# Altium schematic sheet Connectors-SD.SchDoc
size B; SheetNumber: 2; SheetTotal: 5
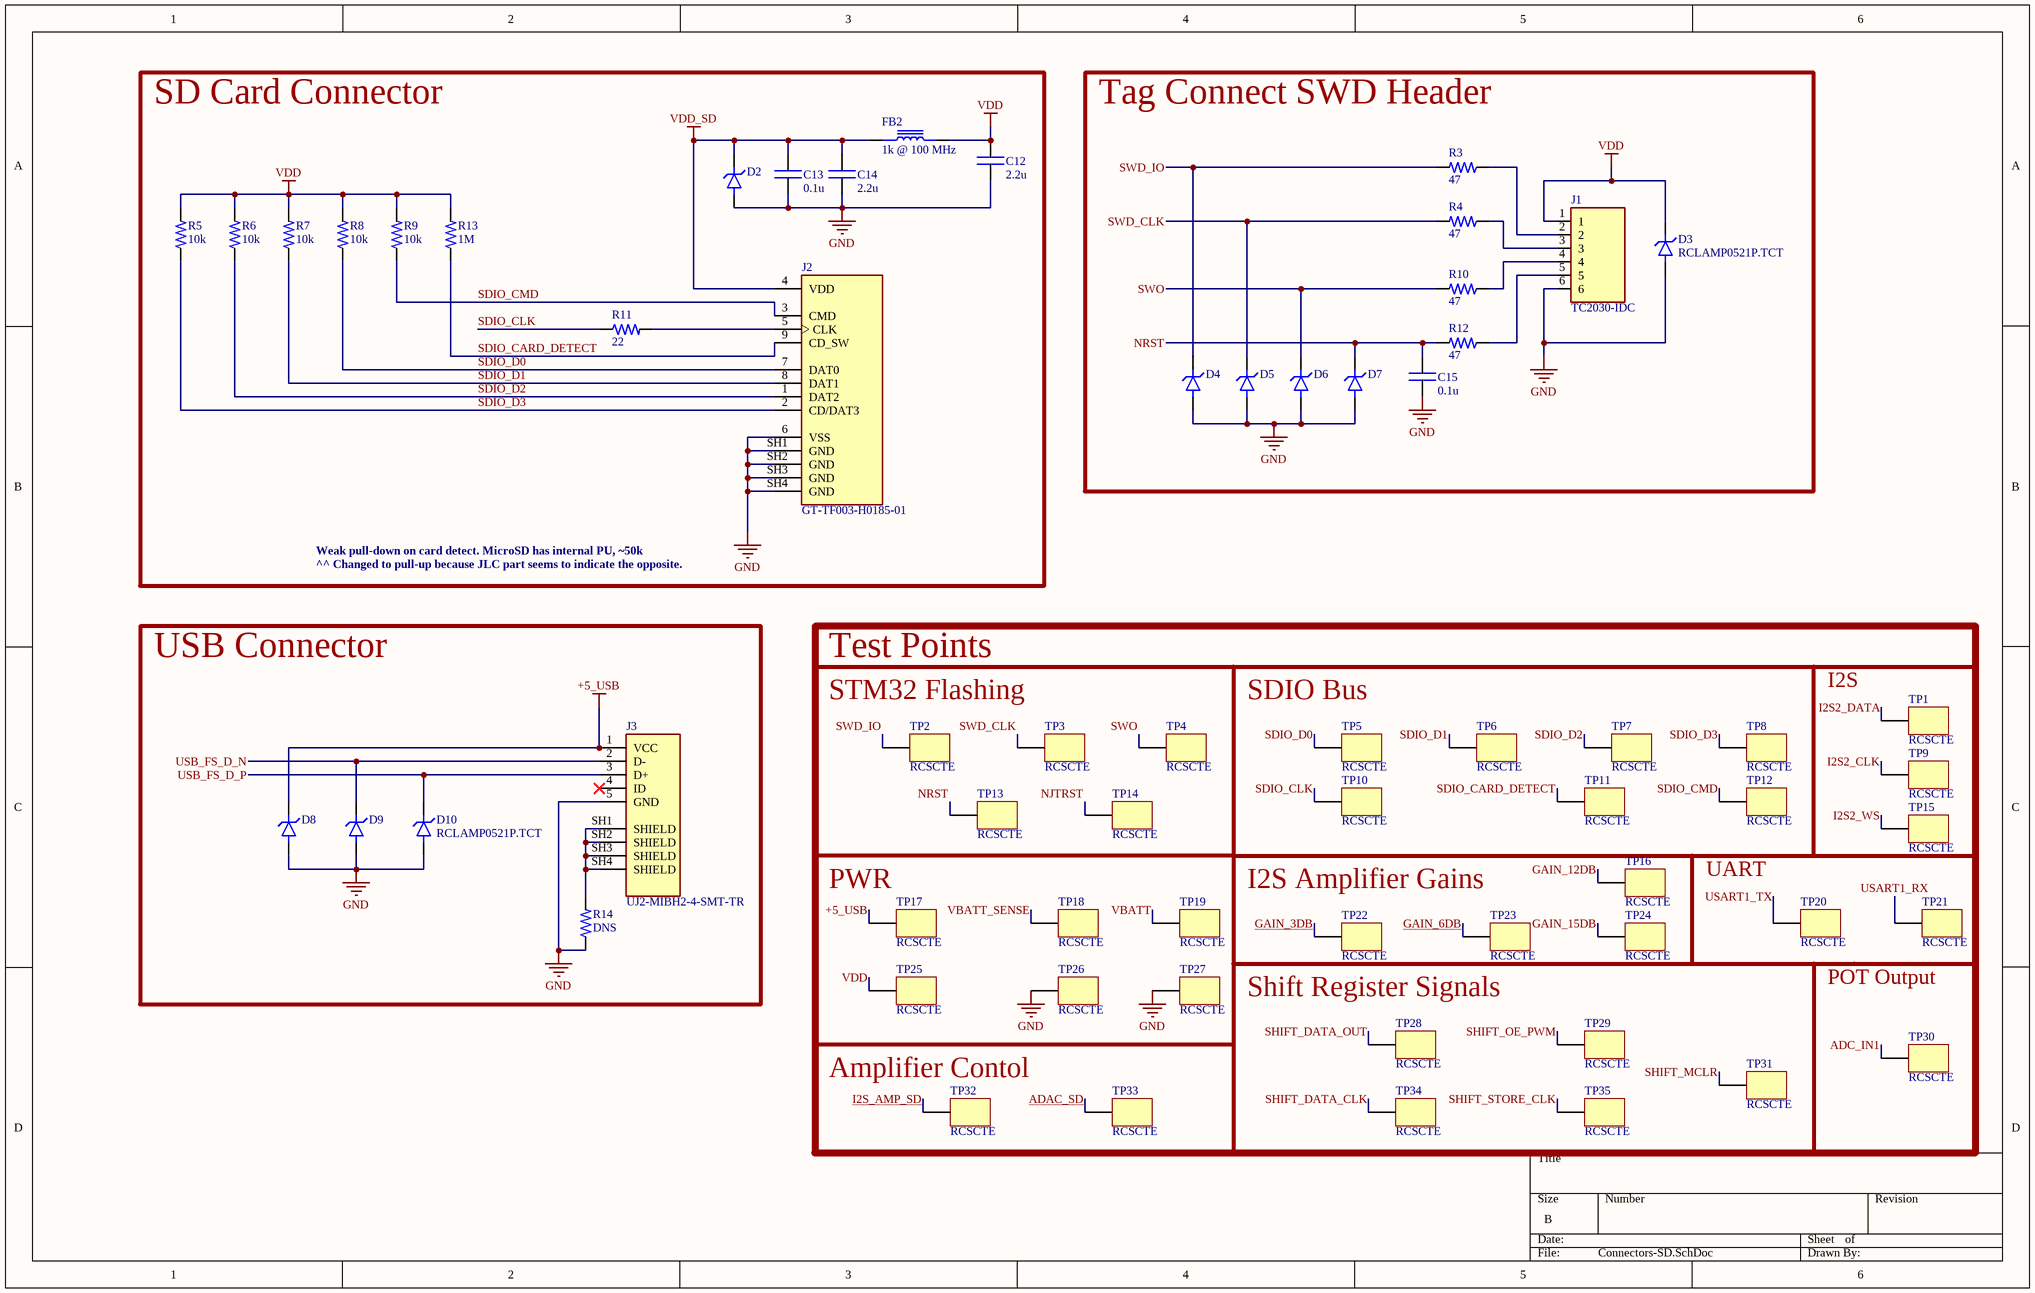
[diagram p0: Connectors-SD.SchDoc]

## Parts
C12  value 2.2u  [0603-CAP]  (hidden comment: CAP)
C13  value 0.1u  [0603-CAP]  (hidden comment: CAP)
C14  value 2.2u  [0603-CAP]  (hidden comment: CAP)
C15  value 0.1u  [0603-CAP]  (hidden comment: CAP)
D2  RCLAMP0521P.TCT  [RCLAMP0521P.TCT]  (value not drawn)
D3  RCLAMP0521P.TCT  [RCLAMP0521P.TCT]
D4  RCLAMP0521P.TCT  [RCLAMP0521P.TCT]  (value not drawn)
D5  RCLAMP0521P.TCT  [RCLAMP0521P.TCT]  (value not drawn)
D6  RCLAMP0521P.TCT  [RCLAMP0521P.TCT]  (value not drawn)
D7  RCLAMP0521P.TCT  [RCLAMP0521P.TCT]  (value not drawn)
D8  RCLAMP0521P.TCT  [RCLAMP0521P.TCT]  (value not drawn)
D9  RCLAMP0521P.TCT  [RCLAMP0521P.TCT]  (value not drawn)
D10  RCLAMP0521P.TCT  [RCLAMP0521P.TCT]
FB2  1k @ 100 MHz  [0603-FB]
J1  TC2030-IDC  [TAG CONNECT TC2030IDC - NO 3D MODEL]
J2  GT-TF003-H0185-01  [GTTF003H018501]
J3  UJ2-MIBH2-4-SMT-TR  [USB MICRO JLC]
R3  value 47  [0603-RES]  (hidden comment: RES)
R4  value 47  [0603-RES]  (hidden comment: RES)
R5  value 10k  [0603-RES]  (hidden comment: RES)
R6  value 10k  [0603-RES]  (hidden comment: RES)
R7  value 10k  [0603-RES]  (hidden comment: RES)
R8  value 10k  [0603-RES]  (hidden comment: RES)
R9  value 10k  [0603-RES]  (hidden comment: RES)
R10  value 47  [0603-RES]  (hidden comment: RES)
R11  value 22  [0603-RES]  (hidden comment: RES)
R12  value 47  [0603-RES]  (hidden comment: RES)
R13  value 1M  [0603-RES]  (hidden comment: RES)
R14  value DNS  [0603-RES]  (hidden comment: RES)
TP1  RCSCTE  [RCWCTE]
TP2  RCSCTE  [RCWCTE]
TP3  RCSCTE  [RCWCTE]
TP4  RCSCTE  [RCWCTE]
TP5  RCSCTE  [RCWCTE]
TP6  RCSCTE  [RCWCTE]
TP7  RCSCTE  [RCWCTE]
TP8  RCSCTE  [RCWCTE]
TP9  RCSCTE  [RCWCTE]
TP10  RCSCTE  [RCWCTE]
TP11  RCSCTE  [RCWCTE]
TP12  RCSCTE  [RCWCTE]
TP13  RCSCTE  [RCWCTE]
TP14  RCSCTE  [RCWCTE]
TP15  RCSCTE  [RCWCTE]
TP16  RCSCTE  [RCWCTE]
TP17  RCSCTE  [RCWCTE]
TP18  RCSCTE  [RCWCTE]
TP19  RCSCTE  [RCWCTE]
TP20  RCSCTE  [RCWCTE]
TP21  RCSCTE  [RCWCTE]
TP22  RCSCTE  [RCWCTE]
TP23  RCSCTE  [RCWCTE]
TP24  RCSCTE  [RCWCTE]
TP25  RCSCTE  [RCWCTE]
TP26  RCSCTE  [RCWCTE]
TP27  RCSCTE  [RCWCTE]
TP28  RCSCTE  [RCWCTE]
TP29  RCSCTE  [RCWCTE]
TP30  RCSCTE  [RCWCTE]
TP31  RCSCTE  [RCWCTE]
TP32  RCSCTE  [RCWCTE]
TP33  RCSCTE  [RCWCTE]
TP34  RCSCTE  [RCWCTE]
TP35  RCSCTE  [RCWCTE]

## Blocks framed on the sheet
SD Card Connector: C12-C14 D2 FB2 J2 R5-R9 R11 R13
Tag Connect SWD Header: C15 D3-D7 J1 R3 R4 R10 R12
USB Connector: D8-D10 J3 R14
Test Points: TP1-TP35

## Nets
+5_USB: D8.K J3.1(VCC) TP17.1
GND: C12.1 C13.1 C14.1 C15.1 D2.A D3.A D4.A D5.A D6.A D7.A D8.A D9.A D10.A J1.6 J2.6(VSS) J2.SH1(GND) J2.SH2(GND) J2.SH3(GND) J2.SH4(GND) J3.5(GND) R14.1 TP26.1 TP27.1
VDD: C12.2 D3.K FB2.2 J1.1 R5.2 R6.2 R7.2 R8.2 R9.2 R13.2 TP25.1
VDD_SD: C13.2 C14.2 D2.K FB2.1 J2.4(VDD)
ADAC_SD: TP33.1
ADC_IN1: TP30.1
GAIN_3DB: TP22.1
GAIN_6DB: TP23.1
GAIN_12DB: TP16.1
GAIN_15DB: TP24.1
I2S2_CLK: TP9.1
I2S2_DATA: TP1.1
I2S2_WS: TP15.1
I2S_AMP_SD: TP32.1
NJTRST: TP14.1
NRST: C15.2 D7.K R12.2 TP13.1
SDIO_CARD_DETECT: J2.9(CD_SW) R13.1 TP11.1
SDIO_CLK: R11.1 TP10.1
SDIO_CMD: J2.3(CMD) R9.1 TP12.1
SDIO_D0: J2.7(DAT0) R8.1 TP5.1
SDIO_D1: J2.8(DAT1) R7.1 TP6.1
SDIO_D2: J2.1(DAT2) R6.1 TP7.1
SDIO_D3: J2.2(CD/DAT3) R5.1 TP8.1
SHIFT_DATA_CLK: TP34.1
SHIFT_DATA_OUT: TP28.1
SHIFT_MCLR: TP31.1
SHIFT_OE_PWM: TP29.1
SHIFT_STORE_CLK: TP35.1
SWD_CLK: D5.K R4.2 TP3.1
SWD_IO: D4.K R3.2 TP2.1
SWO: D6.K R10.2 TP4.1
USART1_RX: TP21.1
USART1_TX: TP20.1
USB_FS_D_N: D9.K J3.2(D-)
USB_FS_D_P: D10.K J3.3(D+)
VBATT: TP19.1
VBATT_SENSE: TP18.1
NetJ1_2: J1.2 R3.1
NetJ1_3: J1.3 R4.1
NetJ1_4: J1.4 R10.1
NetJ1_5: J1.5 R12.1
NetJ2_5: J2.5(CLK) R11.2
NetJ3_SH1: J3.SH1(SHIELD) J3.SH2(SHIELD) J3.SH3(SHIELD) J3.SH4(SHIELD) R14.2

Not connected (* = marked no-connect by the designer): J3 4(ID)*

## Notes on the sheet
- Weak pull-down on card detect. MicroSD has internal PU, ~50k
- ^^ Changed to pull-up because JLC part seems to indicate the opposite.
- STM32 Flashing
- (near TP5) SDIO Bus
- I2S
- (near TP17) PWR
- I2S Amplifier Gains
- UART
- Shift Register Signals
- POT Output
- (near TP32) Amplifier Contol

## Library data of the parts
C12-C15 = CAP: Capaicitor; Type: SMD; MFR: *; MFR PN: *
D2-D10 = TVS DIODE: 25V Clamp 4A (8/20µs) Ipp Tvs Diode Surface Mount SLP1006P2; MFR: Semtech Corporation; Type: SMD; MFR PN: RCLAMP0521P.TCT
FB2 = FERRITE BEAD: MFR: TDK; MFR PN: MMZ1608Y102BTD25; Type: SMD
J1 = TAG CONNECT POGO HEADER: "Plug of Nails" POGO Pin connector; MFR: Tag-Connect; MFR PN: TC2030-IDC
J2 = SD-CONN-SMD_JLC: MFR: G-Switch; MFR PN: GT-TF003-H0185-01; Type: SMD
J3 = Micro USB Port: Micro B, USB 2.0, 1.8 A, Right Angle, Surface Mount (SMT), USB Receptacle; MFR: D-CHAIN; MFR PN: UA0507065250-037-06
R3-R14 = RES: Resistor; MFR PN: *; MFR: *; Type: SMD
TP1-TP35 = Test Point: Test Point, Surface Mount; MFR: KOA Speer Electronics, Inc.; MFR PN: RCSCTE; Type: SMD